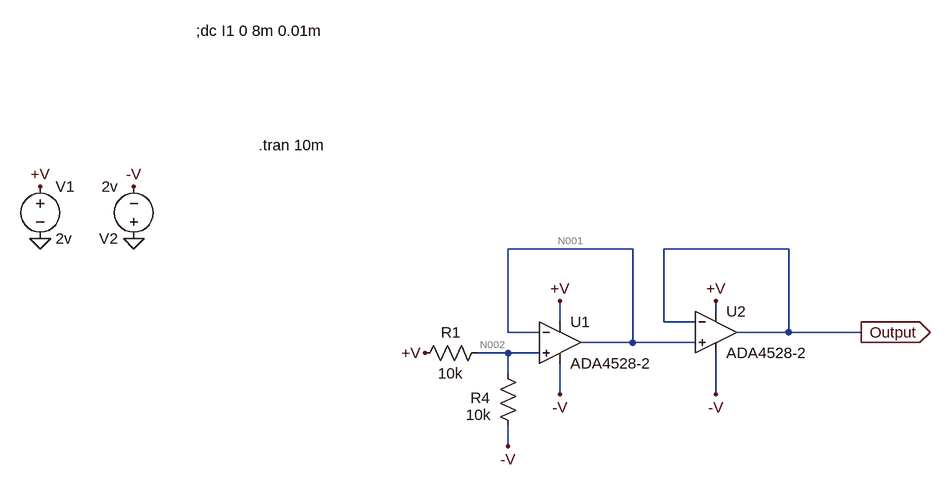
[diagram p0: schematic voltageFollower.asc]
voltageFollower.asc, the LTspice schematic file:
Version 4
SHEET 1 880 680
WIRE 80 -32 -112 -32
WIRE 320 -32 128 -32
WIRE 208 64 208 48
WIRE -32 80 -32 48
WIRE 128 80 128 -32
WIRE 176 80 128 80
WIRE -112 96 -112 -32
WIRE -64 96 -112 96
WIRE 320 96 320 -32
WIRE 320 96 240 96
WIRE 432 96 320 96
WIRE 80 112 80 -32
WIRE 80 112 0 112
WIRE 176 112 80 112
WIRE -112 128 -160 128
WIRE -64 128 -112 128
WIRE -112 160 -112 128
WIRE -32 192 -32 144
WIRE 208 192 208 128
WIRE -112 272 -112 240
FLAG 432 96 Output
IOPIN 432 96 Out
FLAG -832 -48 0
FLAG -832 -128 +V
FLAG -688 -48 0
FLAG -688 -128 -V
FLAG -32 48 +V
FLAG 208 48 +V
FLAG -112 272 -V
FLAG -32 192 -V
FLAG 208 192 -V
FLAG -240 128 +V
SYMBOL voltage -832 -144 R0
WINDOW 123 0 0 Left 0
WINDOW 39 0 0 Left 0
SYMATTR InstName V1
SYMATTR Value 2v
SYMBOL res -96 256 R180
WINDOW 0 43 59 Left 2
WINDOW 3 42 33 Left 2
SYMATTR InstName R4
SYMATTR Value 10k
SYMBOL voltage -688 -32 R180
WINDOW 123 0 0 Left 0
WINDOW 39 0 0 Left 0
SYMATTR InstName V2
SYMATTR Value 2v
SYMBOL OpAmps\\ADA4528-2 -32 48 R0
SYMATTR InstName U1
SYMBOL OpAmps\\ADA4528-2 208 32 R0
SYMATTR InstName U2
SYMBOL res -256 144 R270
WINDOW 0 32 56 VTop 2
WINDOW 3 0 56 VBottom 2
SYMATTR InstName R1
SYMATTR Value 10k
TEXT -592 -368 Left 2 !;dc I1 0 8m 0.01m
TEXT -496 -192 Left 2 !.tran 10m

The netlist it stands for:
* voltageFollower.asc
V1 +V 0 2v
R4 -V N002 10k
V2 0 -V 2v
XU1 N002 N001 +V -V N001 ADA4528-2  ; pins In+ In- V+ V- OUT
XU2 N001 Output +V -V Output ADA4528-2  ; pins In+ In- V+ V- OUT
R1 +V N002 10k
;dc I1 0 8m 0.01m
.tran 10m
.backanno
.end

* Results of the author's LTspice run, read from the files saved beside the schematic
* Operating Point, zero values left out:
*   V(+v) = 2 V
*   V(-v) = -2 V
*   V(n002) = -711.9 nV
*   V(n001) = -246.8 nV
*   V(output) = 218.3 nV
*   I(R1) = 200 µA
*   I(R4) = -200 µA
*   I(V2) = -3.121 mA
*   I(V1) = -3.121 mA
*   Ix(u1:1) = 142.4 pA
*   Ix(u1:2) = -142.4 pA
*   Ix(u1:3) = 1.461 mA
*   Ix(u1:4) = -1.461 mA
*   Ix(u2:1) = 142.4 pA
*   Ix(u2:2) = -142.4 pA
*   Ix(u2:3) = 1.461 mA
*   Ix(u2:4) = -1.461 mA
*   Ix(u2:5) = 142.4 pA